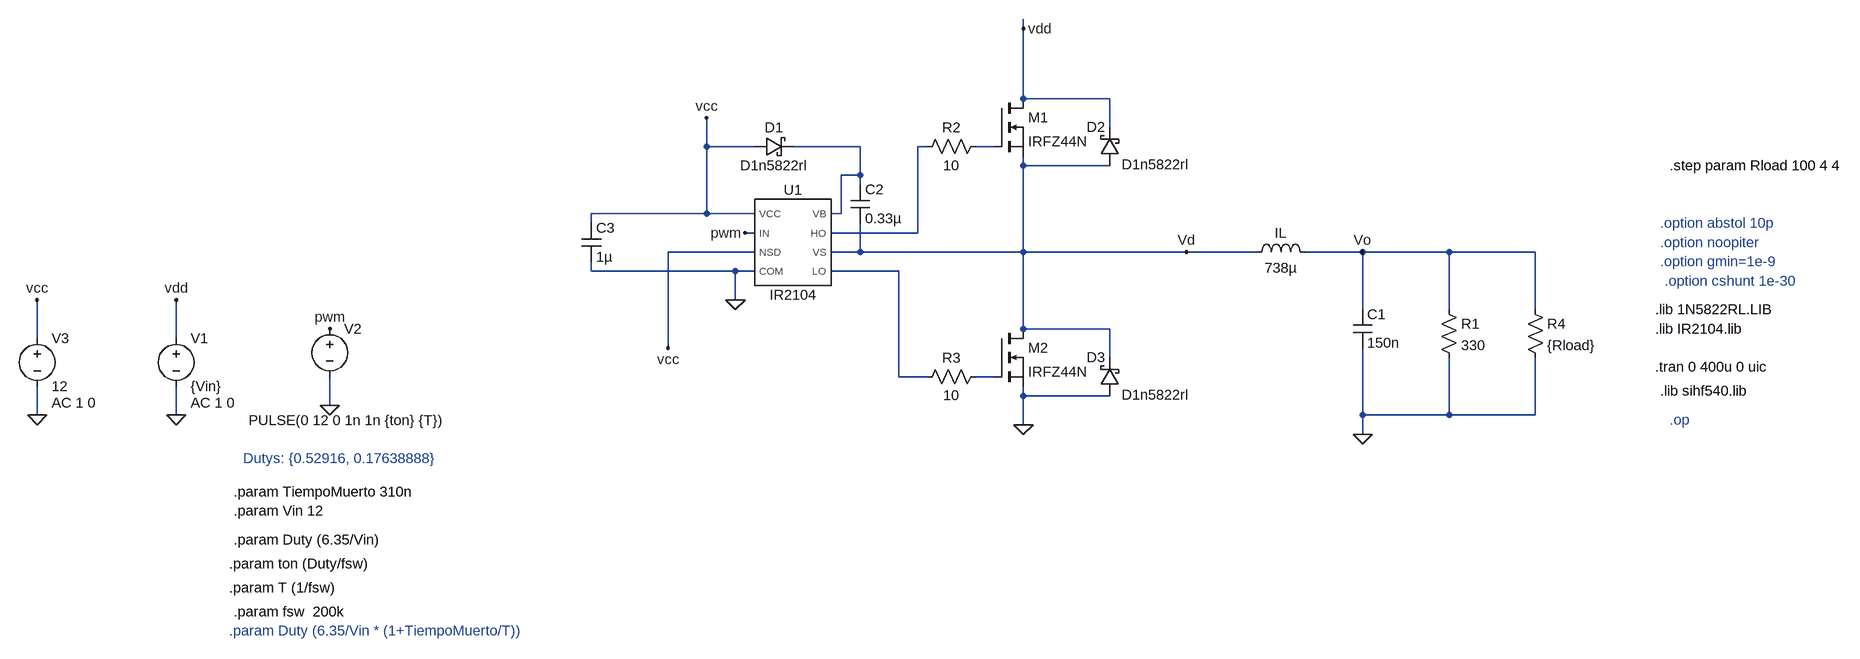
[diagram p0: schematic Buck-lazo-abierto.asc]
Buck-lazo-abierto.asc, the LTspice schematic file:
Version 4
SHEET 1 3480 1872
WIRE 256 -288 256 -304
WIRE 256 -160 256 -288
WIRE 400 -160 256 -160
WIRE 400 -112 400 -160
WIRE -272 -80 -272 -128
WIRE -192 -80 -272 -80
WIRE -16 -80 -128 -80
WIRE 96 -80 80 -80
WIRE 208 -80 176 -80
WIRE 256 -48 256 -64
WIRE 400 -48 256 -48
WIRE -16 -32 -16 -80
WIRE -16 -32 -48 -32
WIRE -16 -16 -16 -32
WIRE -272 32 -272 -80
WIRE -272 32 -464 32
WIRE -192 32 -272 32
WIRE -48 32 -48 -32
WIRE -48 32 -64 32
WIRE -464 48 -464 32
WIRE -192 64 -208 64
WIRE 80 64 80 -80
WIRE 80 64 -64 64
WIRE -192 96 -336 96
WIRE -16 96 -16 48
WIRE -16 96 -64 96
WIRE 256 96 256 -48
WIRE 256 96 -16 96
WIRE 528 96 256 96
WIRE 672 96 528 96
WIRE 848 96 752 96
WIRE 992 96 848 96
WIRE 1136 96 992 96
WIRE -464 128 -464 112
WIRE -224 128 -464 128
WIRE -192 128 -224 128
WIRE 48 128 -64 128
WIRE -224 176 -224 128
WIRE 848 192 848 96
WIRE 992 192 992 96
WIRE 1136 192 1136 96
WIRE 256 224 256 96
WIRE 400 224 256 224
WIRE -1456 240 -1456 176
WIRE -1216 240 -1216 176
WIRE -336 256 -336 96
WIRE 400 272 400 224
WIRE 48 304 48 128
WIRE 96 304 48 304
WIRE 208 304 176 304
WIRE 256 336 256 320
WIRE 400 336 256 336
WIRE -960 352 -960 304
WIRE -1456 368 -1456 320
WIRE -1216 368 -1216 320
WIRE 848 368 848 256
WIRE 992 368 992 272
WIRE 992 368 848 368
WIRE 1136 368 1136 272
WIRE 1136 368 992 368
WIRE 256 384 256 336
WIRE 848 400 848 368
FLAG 848 400 0
FLAG 848 96 Vo
FLAG 528 96 Vd
FLAG -960 352 0
FLAG -960 224 pwm
FLAG -1216 368 0
FLAG -1216 176 vdd
FLAG 256 384 0
FLAG 256 -288 vdd
FLAG -208 64 pwm
FLAG -224 176 0
FLAG -272 -128 vcc
FLAG -336 256 vcc
FLAG -1456 368 0
FLAG -1456 176 vcc
SYMBOL voltage -960 208 R0
WINDOW 3 -135 169 Left 2
WINDOW 123 0 0 Left 0
WINDOW 39 0 0 Left 0
SYMATTR Value PULSE(0 12 0 1n 1n {ton} {T})
SYMATTR InstName V2
SYMBOL ind 656 112 R270
WINDOW 0 32 56 VTop 2
WINDOW 3 5 56 VBottom 2
SYMATTR InstName IL
SYMATTR Value 738µ
SYMBOL cap 832 192 R0
SYMATTR InstName C1
SYMATTR Value 150n
SYMBOL res 976 176 R0
SYMATTR InstName R1
SYMATTR Value 330
SYMBOL voltage -1216 224 R0
WINDOW 123 24 124 Left 2
WINDOW 39 0 0 Left 0
SYMATTR Value2 AC 1 0
SYMATTR InstName V1
SYMATTR Value {Vin}
SYMBOL res 192 -96 R90
WINDOW 0 0 56 VBottom 2
WINDOW 3 32 56 VTop 2
SYMATTR InstName R2
SYMATTR Value 10
SYMBOL cap -32 -16 R0
SYMATTR InstName C2
SYMATTR Value 0.33µ
SYMBOL schottky -192 -64 R270
WINDOW 0 32 32 VTop 2
WINDOW 3 0 32 VBottom 2
SYMATTR InstName D1
SYMATTR Value D1n5822rl
SYMATTR Description Diode
SYMATTR Type diode
SYMBOL cap -480 48 R0
SYMATTR InstName C3
SYMATTR Value 1µ
SYMBOL res 192 288 R90
WINDOW 0 0 56 VBottom 2
WINDOW 3 32 56 VTop 2
SYMATTR InstName R3
SYMATTR Value 10
SYMBOL voltage -1456 224 R0
WINDOW 123 24 124 Left 2
WINDOW 39 0 0 Left 0
SYMATTR Value2 AC 1 0
SYMATTR InstName V3
SYMATTR Value 12
SYMBOL schottky 416 -48 R180
WINDOW 0 24 64 Left 2
WINDOW 3 -4 2 Right 2
SYMATTR InstName D2
SYMATTR Value D1n5822rl
SYMATTR Description Diode
SYMATTR Type diode
SYMBOL nmos 208 -160 R0
SYMATTR InstName M1
SYMATTR Value IRFZ44N
SYMBOL schottky 416 336 R180
WINDOW 0 24 64 Left 2
WINDOW 3 -4 2 Right 2
SYMATTR InstName D3
SYMATTR Value D1n5822rl
SYMATTR Description Diode
SYMATTR Type diode
SYMBOL nmos 208 224 R0
SYMATTR InstName M2
SYMATTR Value IRFZ44N
SYMBOL res 1120 176 R0
SYMATTR InstName R4
SYMATTR Value {Rload}
SYMBOL IR2104 -128 80 R0
SYMATTR InstName U1
TEXT 1704 224 Left 2 !.lib IR2104.lib
TEXT 1704 192 Left 2 !.lib 1N5822RL.LIB
TEXT 1712 80 Left 2 ;.option noopiter
TEXT 1712 112 Left 2 ;.option gmin=1e-9
TEXT -1120 496 Left 2 !.param TiempoMuerto 310n
TEXT -1104 440 Left 2 ;Dutys: {0.52916, 0.17638888}
TEXT -1120 576 Left 2 !.param Duty (6.35/Vin)
TEXT -1120 696 Left 2 !.param fsw  200k
TEXT -1128 616 Left 2 !.param ton (Duty/fsw)
TEXT -1120 528 Left 2 !.param Vin 12
TEXT -1128 656 Left 2 !.param T (1/fsw)
TEXT -1128 728 Left 2 ;.param Duty (6.35/Vin * (1+TiempoMuerto/T))
TEXT 1704 288 Left 2 !.tran 0 400u 0 uic
TEXT 1720 144 Left 2 ;.option cshunt 1e-30
TEXT 1712 48 Left 2 ;.option abstol 10p
TEXT 1712 328 Left 2 !.lib sihf540.lib
TEXT 1728 376 Left 2 ;.op
TEXT 1728 -48 Left 2 !.step param Rload 100 4 4

The netlist it stands for:
* Buck-lazo-abierto.asc
V2 pwm 0 PULSE(0 12 0 1n 1n {ton} {T})
L§IL Vd Vo 738µ
C1 Vo 0 150n
R1 Vo 0 330
V1 vdd 0 {Vin} AC 1 0
R2 N003 N002 10
C2 N001 Vd 0.33µ
D1 vcc N001 D1n5822rl
C3 vcc 0 1µ
R3 N005 N004 10
V3 vcc 0 12 AC 1 0
D2 Vd vdd D1n5822rl
M1 vdd N003 Vd Vd IRFZ44N
D3 0 Vd D1n5822rl
M2 Vd N005 0 0 IRFZ44N
R4 Vo 0 {Rload}
XU1 N004 N002 0 pwm vcc N001 Vd vcc IR2104  ; pins LO HO COM IN VCC VB VS NSD
.model D D
.lib standard.dio
.model NMOS NMOS
.model PMOS PMOS
.lib standard.mos
.lib IR2104.lib
.lib 1N5822RL.LIB
* .option noopiter
* .option gmin=1e-9
.param TiempoMuerto 310n
* Dutys: {0.52916, 0.17638888}
.param Duty (6.35/Vin)
.param fsw  200k
.param ton (Duty/fsw)
.param Vin 12
.param T (1/fsw)
* .param Duty (6.35/Vin * (1+TiempoMuerto/T))
.tran 0 400u 0 uic
* .option cshunt 1e-30
* .option abstol 10p
.lib sihf540.lib
* .op
.step param Rload 100 4 4
.lib C:\Users\---\Desktop\DCE\dce-g5-proyecto_integrador\Checkpoint 4\Buck\IR2104.lib
.backanno
.end